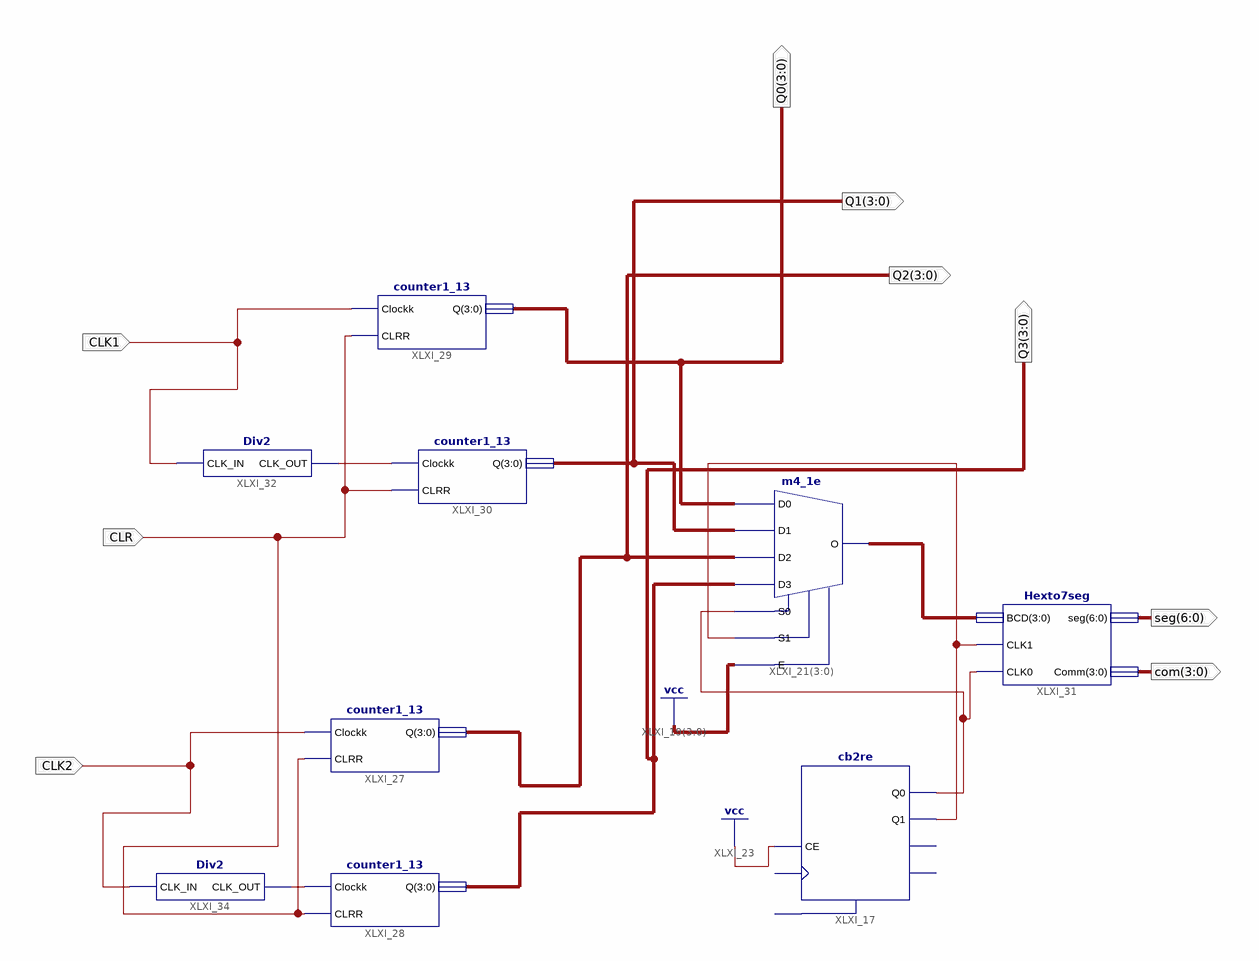
[diagram p0: schematic sheet 1]
// Xilinx ISE schematic random2digit.sch (spartan6) as structural Verilog: 9 symbols, 9 ports
module random2digit (
  input  CLK2,
  input  CLK1,
  input  CLR,
  output [3:0] Q0,
  output [3:0] Q2,
  output [3:0] Q3,
  output [3:0] Q1,
  output [6:0] seg,
  output [3:0] com
);

  wire XLXN_20, XLXN_46, XLXN_47, XLXN_60;
  wire [3:0] XLXN_45;

  cb2re XLXI_17 (.CE(1'b1), .Q0(XLXN_46), .Q1(XLXN_47));  // open: C, R, CEO, TC
  m4_1e XLXI_21[3:0] (.D0(Q0), .D1(Q1), .D2(Q2), .D3(Q3), .E(4'b1111), .S0(XLXN_46), .S1(XLXN_47), .O(XLXN_45));
  counter1_13 XLXI_27 (.Clockk(CLK2), .CLRR(CLR), .Q(Q2));
  counter1_13 XLXI_28 (.Clockk(XLXN_20), .CLRR(CLR), .Q(Q3));
  counter1_13 XLXI_29 (.Clockk(CLK1), .CLRR(CLR), .Q(Q0));
  counter1_13 XLXI_30 (.Clockk(XLXN_60), .CLRR(CLR), .Q(Q1));
  Hexto7seg XLXI_31 (.BCD(XLXN_45), .CLK1(XLXN_47), .CLK0(XLXN_46), .seg(seg), .Comm(com));
  Div2 XLXI_32 (.CLK_IN(CLK1), .CLK_OUT(XLXN_60));
  Div2 XLXI_34 (.CLK_IN(CLK2), .CLK_OUT(XLXN_20));
endmodule
